# Altium schematic sheet AUAV_X05_GPS.SchDoc
size 209 x 148 mm
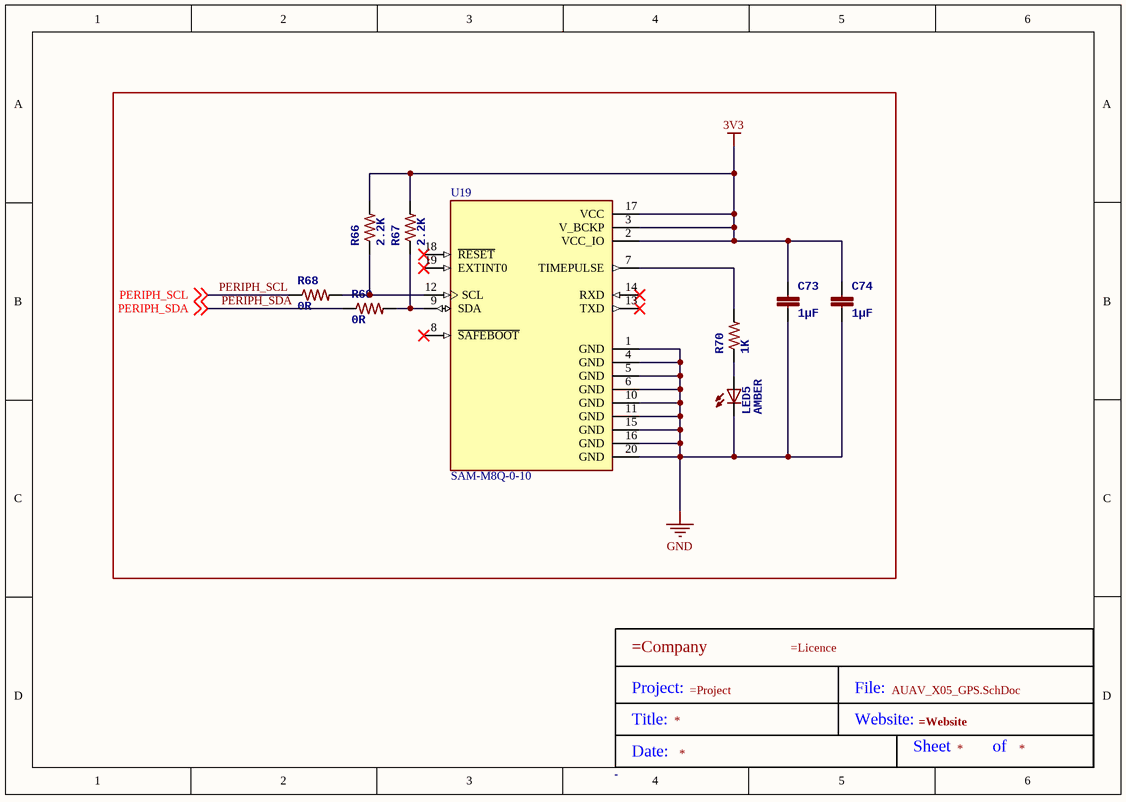
[diagram p0: AUAV_X05_GPS.SchDoc]

## Parts
*?  Title Block  (value not drawn)
C73  1µF  [0402-CAP]
C74  1µF  [0402-CAP]
LED5  AMBER  [0603-LED]
R66  2.2K  [0402-RES]
R67  2.2K  [0402-RES]
R68  0R  [0402-RES]
R69  0R  [0402-RES]
R70  1K  [0402-RES]
U19  SAM-M8Q-0-10  [MODULE_SAM-M8Q-0-10]

## Nets
3V3: C73.P$1 C74.P$1 R66.P$2 R67.P$2 U19.2(VCC_IO) U19.3(V_BCKP) U19.17(VCC)
GND: C73.P$2 C74.P$2 LED5.C U19.1(GND) U19.4(GND) U19.5(GND) U19.6(GND) U19.10(GND) U19.11(GND) U19.15(GND) U19.16(GND) U19.20(GND)
PERIPH_SCL: R68.P$1 ; off-sheet PERIPH_SCL
PERIPH_SDA: R69.P$1 ; off-sheet PERIPH_SDA
NetLED5_A: LED5.A R70.P$1
NetR66_P$1: R66.P$1 R68.P$2 U19.12(SCL)
NetR67_P$1: R67.P$1 R69.P$2 U19.9(SDA)
NetR70_P$2: R70.P$2 U19.7(TIMEPULSE)

Not connected (* = marked no-connect by the designer): U19 8(~{SAFEBOOT})* 13(TXD)* 14(RXD)* 18(~{RESET})* 19(EXTINT0)*

## Notes on the sheet
- (in symbol Title Block) Project:; File:; Title:; Website:; Sheet; of; Date:

## Library data of the parts
C73 C74 = CAP0402: CAP CER 8PF 50V C0G 0402; PARTNO: C1005C0G1H080C; 3DR_PARTNO: ECM0710; Value: 8p; Supplier 1: Digi-Key; Supplier Part Number 1: 445-4890-1-ND
LED5 = LED0603: LED 1.6X0.8 DOME ORN CLEAR SMD; PARTNO: APTD1608SECK; 3DR_PARTNO: ECM0515; Supplier 1: Digi-Key; Value: AMBER; Supplier Part Number 1: 754-1802-1-ND
R66-R70 = RESISTOR0402-RES: RES 10K OHM 1/16W 1% 0402 SMD; PARTNO: RC0402FR-0710KL; 3DR_PARTNO: ECM0800; Supplier 1: Digi-Key; Value: 10K; Supplier Part Number 1: 311-10.0KLRCT-ND
U19 = SAM-M8Q-0-10: Concurrent GNSS LGA antenna module, TCXO, SAW, LNA; MF: U-Blox America; SnapEDA_Link: https://www.snapeda.com/parts/SAM-M8Q-0-10/U-Blox%20America%20Inc./view-part/4176901/?ref=snap; Package: SMD-20 u-blox; Check_prices: https://www.snapeda.com/parts/SAM-M8Q-0-10/U-Blox%20America%20Inc./view-part/4176901/?ref=eda; Availability: Not in stock; Price: None; MP: SAM-M8Q-0-10; Value: *
*? = Title Block: Size: -